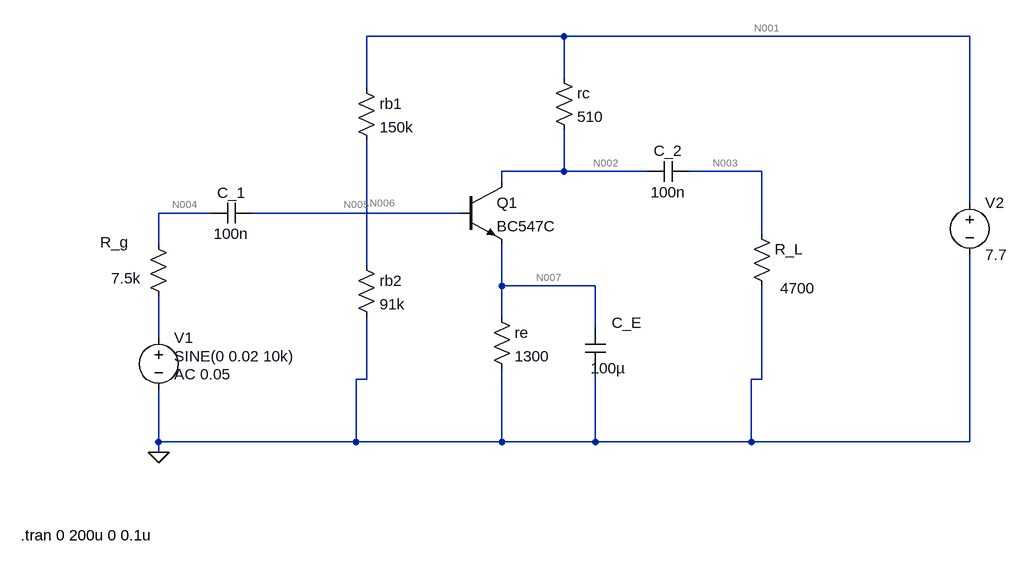
[diagram p0: schematic Draft1.asc]
Draft1.asc, the LTspice schematic file:
Version 4
SHEET 1 1008 680
WIRE 304 -192 0 -192
WIRE 928 -192 304 -192
WIRE 304 -128 304 -192
WIRE 0 -112 0 -192
WIRE 304 16 304 -48
WIRE 304 16 208 16
WIRE 432 16 304 16
WIRE 608 16 496 16
WIRE 208 32 208 16
WIRE 928 64 928 -192
WIRE -240 80 -320 80
WIRE 144 80 -176 80
WIRE 608 112 608 16
WIRE -320 128 -320 80
WIRE 0 160 0 -32
WIRE 208 192 208 128
WIRE 352 192 208 192
WIRE 208 240 208 192
WIRE 352 256 352 192
WIRE -320 272 -320 208
WIRE 0 336 0 240
WIRE 0 336 -16 336
WIRE 608 336 608 192
WIRE 608 336 592 336
WIRE -320 432 -320 352
WIRE -16 432 -16 336
WIRE -16 432 -320 432
WIRE 208 432 208 320
WIRE 208 432 -16 432
WIRE 352 432 352 320
WIRE 352 432 208 432
WIRE 592 432 592 336
WIRE 592 432 352 432
WIRE 928 432 928 144
WIRE 928 432 592 432
WIRE -320 448 -320 432
FLAG -320 448 0
DATAFLAG 384 -192 "$-V(N002)"
SYMBOL npn 144 32 R0
SYMATTR InstName Q1
SYMATTR Value BC547C
SYMBOL voltage -320 256 R0
WINDOW 3 24 44 Left 2
WINDOW 123 24 72 Left 2
WINDOW 39 0 0 Left 0
SYMATTR InstName V1
SYMATTR Value SINE(0 0.02 10k)
SYMATTR Value2 AC 0.05
SYMBOL voltage 928 48 R0
WINDOW 123 0 0 Left 0
WINDOW 39 0 0 Left 0
SYMATTR InstName V2
SYMATTR Value 7.7
SYMBOL res 288 -144 R0
SYMATTR InstName rc
SYMATTR Value 510
SYMBOL res -16 -128 R0
SYMATTR InstName rb1
SYMATTR Value 150k
SYMBOL res -16 144 R0
SYMATTR InstName rb2
SYMATTR Value 91k
SYMBOL res 192 224 R0
SYMATTR InstName re
SYMATTR Value 1300
SYMBOL res 592 96 R0
WINDOW 3 44 100 Left 2
SYMATTR InstName R_L
SYMATTR Value 4700
SYMBOL res -336 112 R0
WINDOW 0 -74 13 Left 2
WINDOW 3 -57 68 Left 2
SYMATTR InstName R_g
SYMATTR Value 7.5k
SYMBOL cap -176 64 R90
WINDOW 0 0 32 VBottom 2
WINDOW 3 32 32 VTop 2
SYMATTR InstName C_1
SYMATTR Value 100n
SYMBOL cap 368 320 R180
WINDOW 0 -56 71 Left 2
WINDOW 3 -31 1 Left 2
SYMATTR InstName C_E
SYMATTR Value 100µ
SYMBOL cap 432 32 R270
WINDOW 0 32 32 VTop 2
WINDOW 3 0 32 VBottom 2
SYMATTR InstName C_2
SYMATTR Value 100n
TEXT -532 576 Left 2 !.tran 0 200u 0 0.1u

The netlist it stands for:
* Draft1.asc
Q1 N002 N005 N007 0 BC547C
V1 N008 0 SINE(0 0.02 10k) AC 0.05
V2 N001 0 7.7
rc N001 N002 510
rb1 N001 N006 150k
rb2 N006 0 91k
re N007 0 1300
R_L N003 0 4700
R_g N004 N008 7.5k
C_1 N005 N004 100n
C_E 0 N007 100µ
C_2 N002 N003 100n
.model NPN NPN
.model PNP PNP
.lib standard.bjt
.tran 0 200u 0 0.1u
.backanno
.end

* Results of the author's LTspice run, read from the files saved beside the schematic
* Operating Point, zero values left out:
*   V(n002) = 7.7 V
*   V(n005) = 280.3 mV
*   V(n007) = 3.18 µV
*   V(n001) = 7.7 V
*   V(n006) = 2.907 V
*   Ic(Q1) = 2.446 nA
*   Ie(Q1) = -2.446 nA
*   I(Re) = 2.446 nA
*   I(Rb2) = 31.95 µA
*   I(Rb1) = 31.95 µA
*   I(Rc) = 2.446 nA
*   I(V2) = -31.95 µA
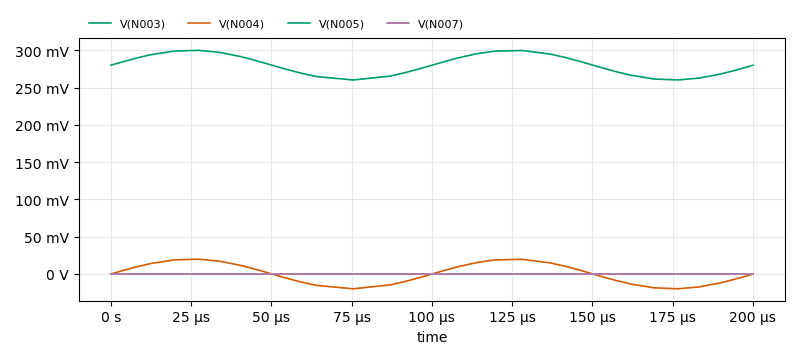
[diagram p1: Transient Analysis of Draft1.asc, plotted from the saved traces]
* Transient Analysis, 1 run:
*   V(N003): min -1.486 µV, max 1.221 µV, average -115.7 nV, rms 942.1 nV, last 979.4 nV
*   V(N004): min -19.96 mV, max 19.81 mV, average 43.53 µV, rms 13.96 mV, last -161.6 µV
*   V(N005): min 260.4 mV, max 300.1 mV, average 280.4 mV, rms 280.7 mV, last 280.2 mV
*   V(N007): min 3.178 µV, max 3.184 µV, average 3.181 µV, rms 3.181 µV, last 3.181 µV